# EAGLE design IGVC_breakout_board (EAGLE 7.1.0)
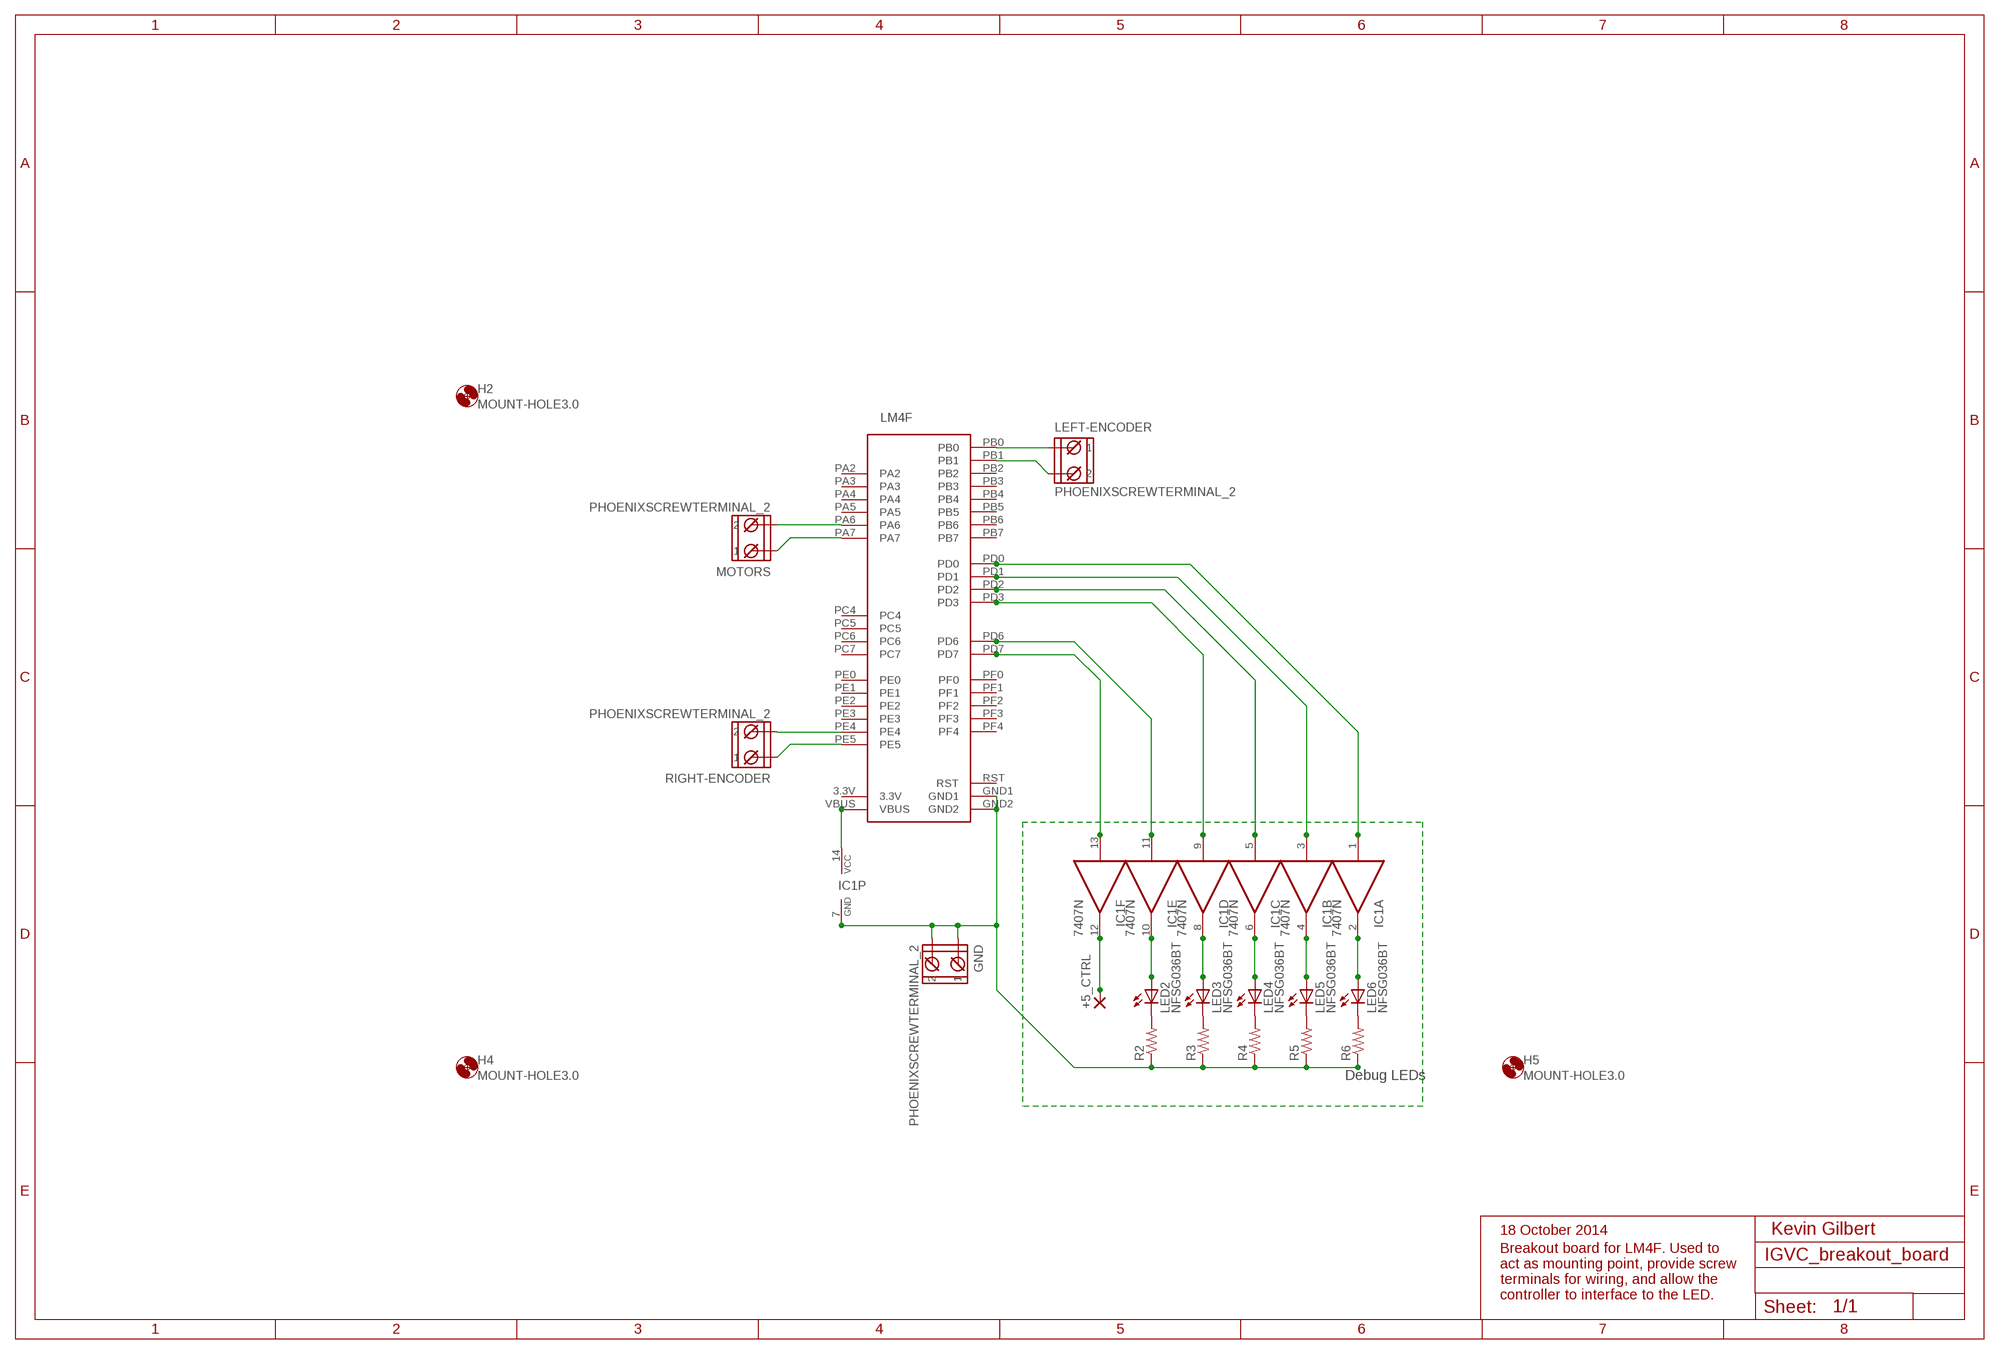
[diagram p0: schematic, sheet 1]

## Parts
+5_CTRL  1,6/0,8  [1,6/0,8]
GND  PHOENIXSCREWTERMINAL_2  [PHOENIXSCREWTERMINAL_2]
H2  MOUNT-HOLE3.0  [3,0]
H4  MOUNT-HOLE3.0  [3,0]
H5  MOUNT-HOLE3.0  [3,0]
IC1  7407N  [DIL14]
LED2  NFSG036BT  [NFSG036BT]
LED3  NFSG036BT  [NFSG036BT]
LED4  NFSG036BT  [NFSG036BT]
LED5  NFSG036BT  [NFSG036BT]
LED6  NFSG036BT  [NFSG036BT]
LEFT-ENCODER  PHOENIXSCREWTERMINAL_2  [PHOENIXSCREWTERMINAL_2]
LM4F  STELLARIS-LAUNCHPADSTELLARIS-LAUNCHPAD-XL  [LAUNCHPAD-XL]
MOTORS  PHOENIXSCREWTERMINAL_2  [PHOENIXSCREWTERMINAL_2]
R2  R-US_M0805  [M0805]
R3  R-US_M0805  [M0805]
R4  R-US_M0805  [M0805]
R5  R-US_M0805  [M0805]
R6  R-US_M0805  [M0805]
RIGHT-ENCODER  PHOENIXSCREWTERMINAL_2  [PHOENIXSCREWTERMINAL_2]

## Nets
GND: GND.1 GND.2 IC1.7(P:GND) LM4F.GND1 LM4F.GND2 R2.1 R3.1 R4.1 R5.1 R6.1
LEFT: IC1.1(A:I) LM4F.PD0
N$1: LM4F.PE4 RIGHT-ENCODER.2
N$2: LM4F.PA6 MOTORS.2
N$3: LM4F.PA7 MOTORS.1
N$4: LM4F.PE5 RIGHT-ENCODER.1
N$5: LEFT-ENCODER.1 LM4F.PB0
N$6: LEFT-ENCODER.2 LM4F.PB1
N$8: +5_CTRL.1(P) IC1.12(F:O)
N$9: LED2.C R2.2
N$10: LED3.C R3.2
N$11: LED4.C R4.2
N$12: LED5.C R5.2
N$13: LED6.C R6.2
N$15: IC1.10(E:O) LED2.A
N$16: IC1.8(D:O) LED3.A
N$17: IC1.6(C:O) LED4.A
N$18: IC1.4(B:O) LED5.A
N$19: IC1.2(A:O) LED6.A
N$21: IC1.3(B:I) LM4F.PD1
N$22: IC1.5(C:I) LM4F.PD2
N$23: IC1.9(D:I) LM4F.PD3
N$24: IC1.11(E:I) LM4F.PD6
N$25: IC1.13(F:I) LM4F.PD7
VBUS: IC1.14(P:VCC) LM4F.VBUS
Unconnected: LM4F.PA2 LM4F.PA3 LM4F.PA4 LM4F.PA5 LM4F.PB2 LM4F.PB3 LM4F.PB4 LM4F.PB5 LM4F.PB6 LM4F.PB7 LM4F.PC4 LM4F.PC5 LM4F.PC6 LM4F.PC7 LM4F.PE0 LM4F.PE1 LM4F.PE2 LM4F.PE3 LM4F.PF0 LM4F.PF1 LM4F.PF2 LM4F.PF3 LM4F.PF4

## Notes on the sheet
- Debug LEDs
- 18 October 2014 | Kevin Gilbert
- Breakout board for LM4F. Used to
  act as mounting point, provide screw
  terminals for wiring, and allow the
  controller to interface to the LED.

## Power pins joined to a net without a drawn wire
3.3V: LM4F.3.3V
RST: LM4F.RST

## Library data of the parts
+5_CTRL = wirepad:1,6/0,8: THROUGH-HOLE PAD
GND LEFT-ENCODER MOTORS RIGHT-ENCODER = RASEagleLib:PHOENIXSCREWTERMINAL_2: Phoenix Screw Terminal 2 contacts, 5 mm pitch Terminal: 1934861 Pins: 1933189
H2 H4 H5 = holes:MOUNT-HOLE: MOUNTING HOLE with drill center marker
IC1 = 74xx-eu:74*07: Hex BUFFER, open collector high-voltage output
LED2-LED6 = led:NFSG036BT: CHIP TYPE GREEN LED NFSx036xT Source: NICHIA CORPORATION .. NFSG036BT-E.pdf
LM4F = StellarisLaunchPad_Fred:STELLARIS-LAUNCHPAD
R2-R6 = resistor:R-US_: RESISTOR, American symbol

## Board
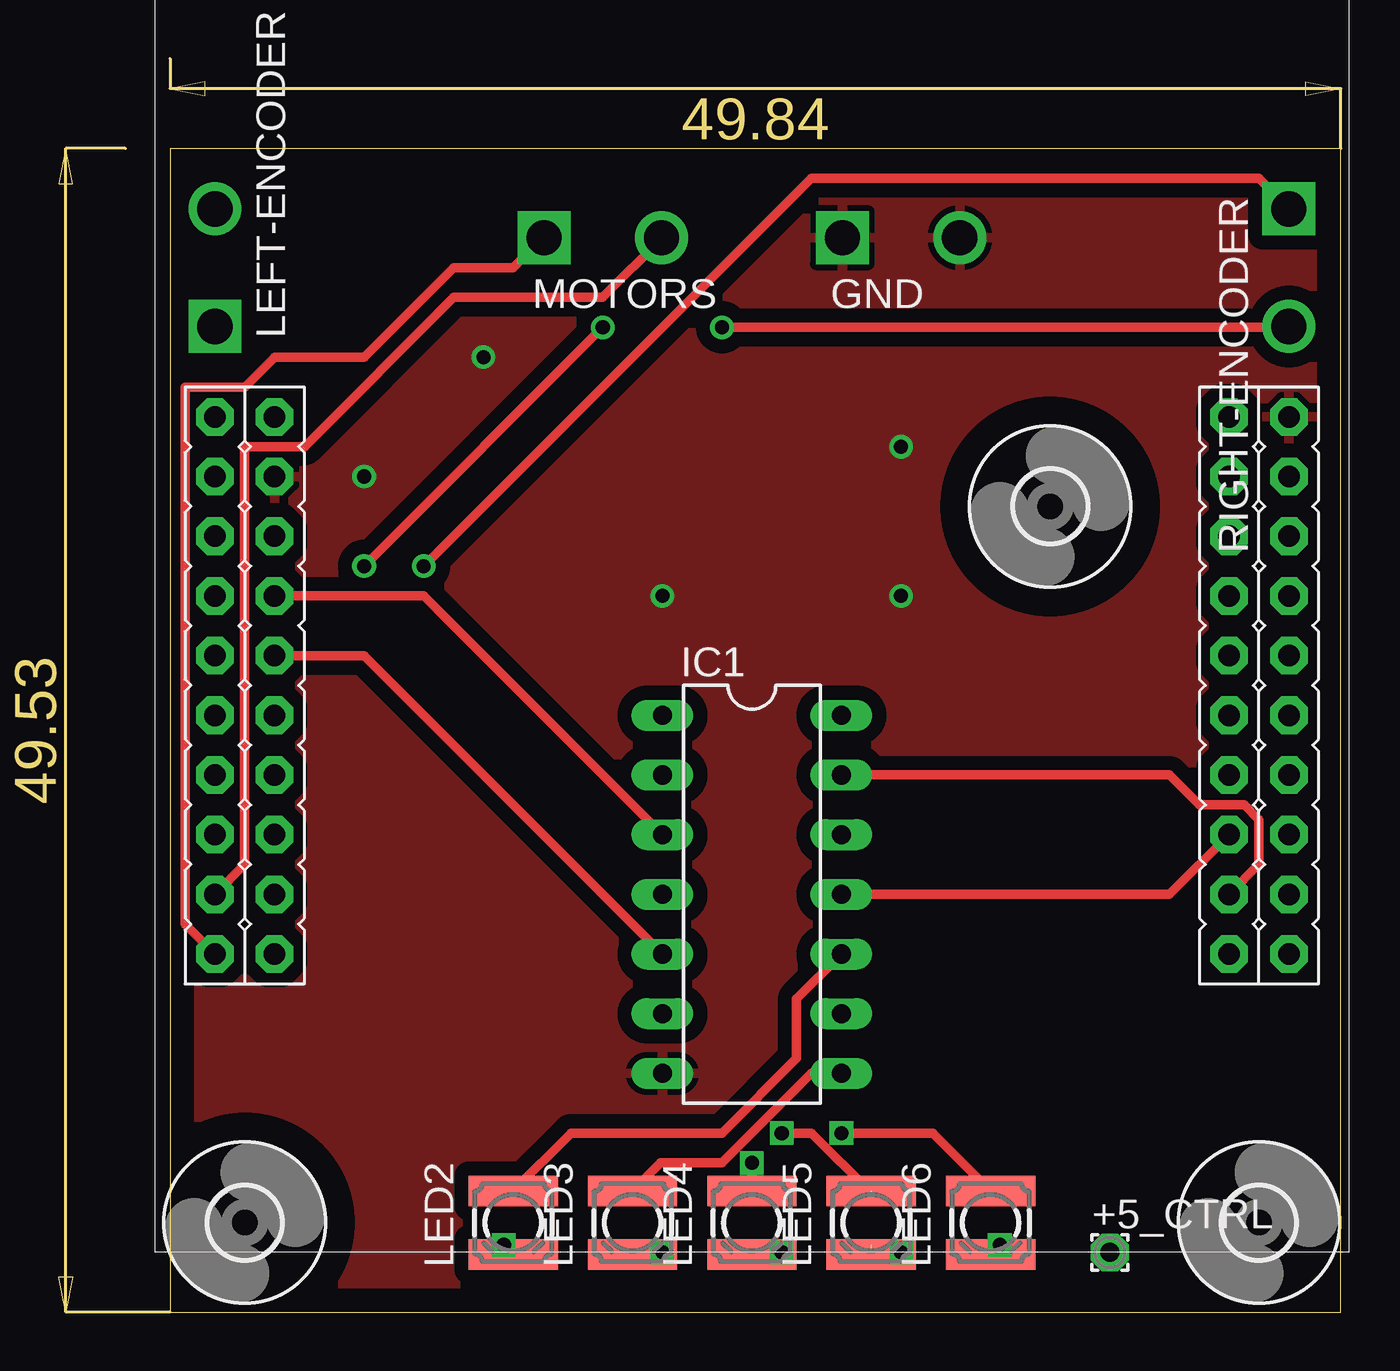
[diagram p1: board, top side]
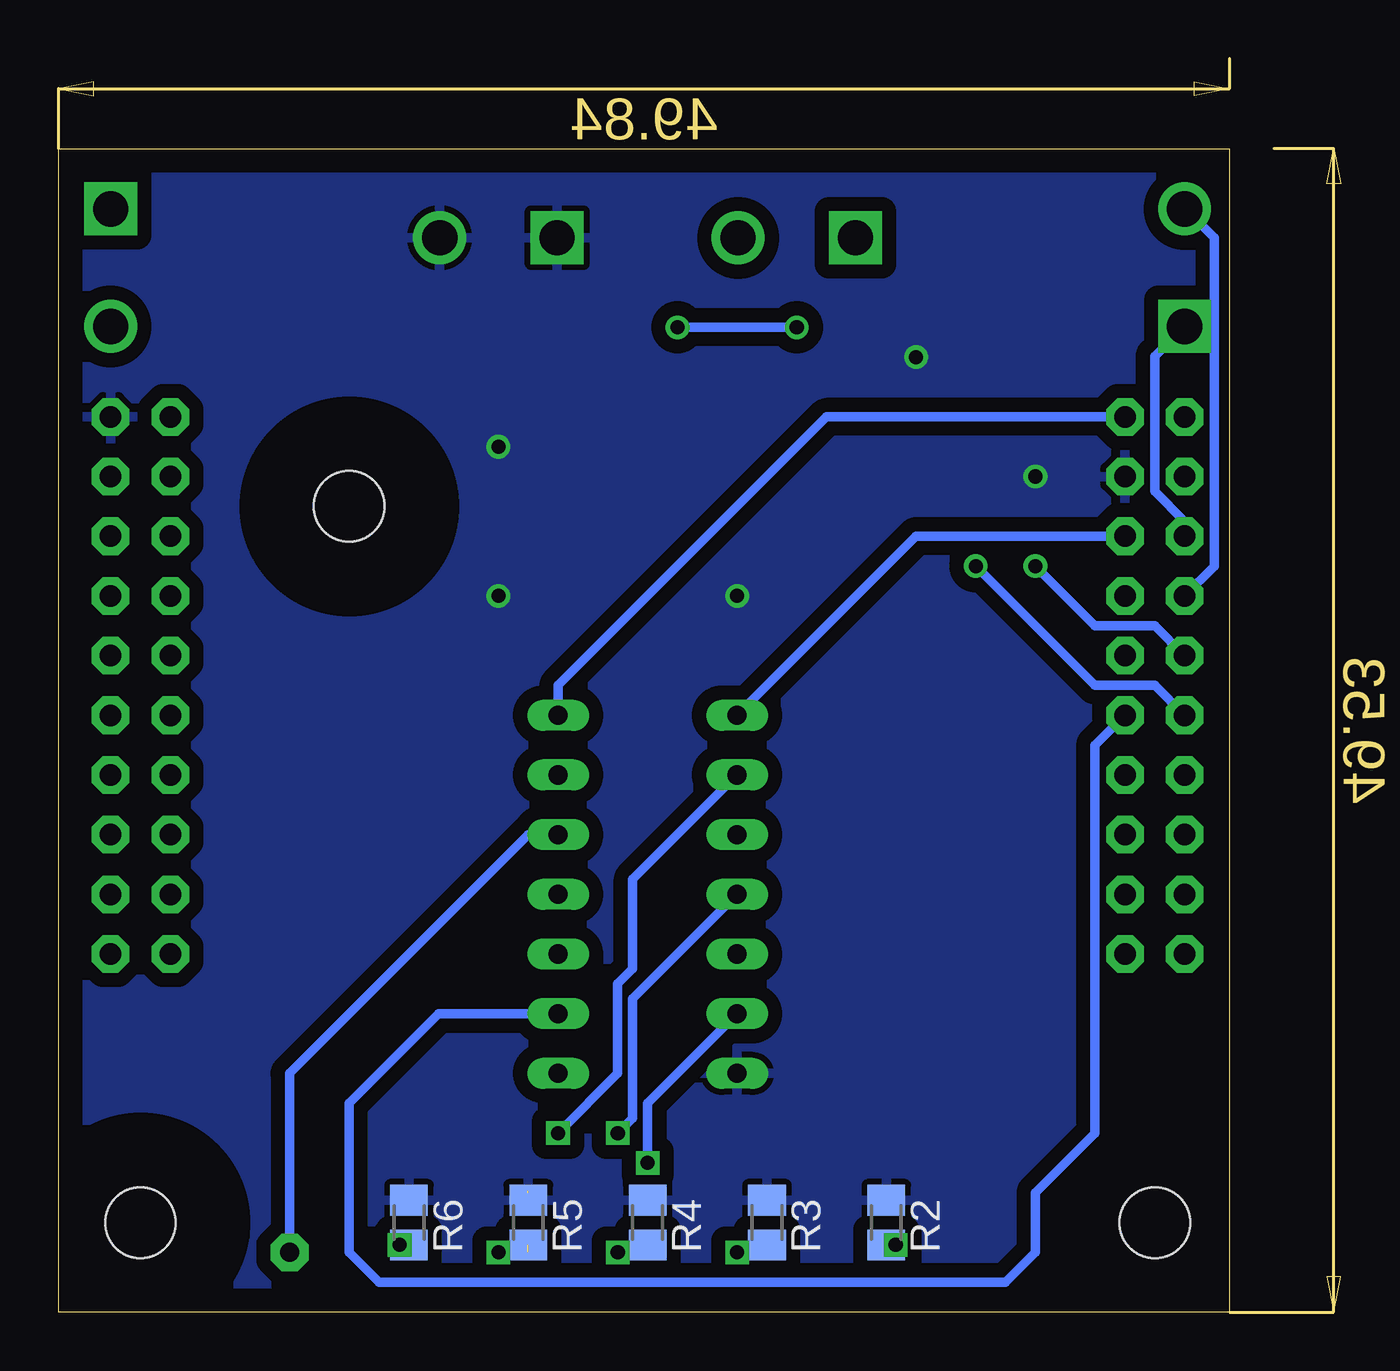
[diagram p2: board, bottom side, seen from below]

Size 49.84 x 49.52 mm. Coordinates in mm from the lower left corner, seen from the top.
Outline: 0,0 49.84,0 49.84,49.52 0,49.52 0,0
Copper layers (1*16): Top 0.035mm / dielectric 1.5mm / Bottom 0.035mm
Design rules "default": minimum track width 10mil, minimum drill 24mil, track to track 8mil, track to pad 8mil, pad to pad 8mil, via to via 8mil, smd to smd 8mil, copper to edge 40mil, drill to drill 8mil, minimum pad ring 10mil, minimum via ring 8mil, stop-mask expansion 4mil, vias tented up to drill 0mil, thermal gap 10mil

### Footprints (pad centres in the part's own frame; a part is rotated, then mirrored left to right if it is on the bottom)
1,6/0,8 = drill 0.813 pad 1.6 octagon: 1 0,0
PHOENIXSCREWTERMINAL_2 = drill 1.5 square: 1 -2.5,0 | drill 1.5: 2 2.5,0
3,0 = hole 3: 0,0
DIL14 = drill 0.813 long: 1 -7.62,-3.81; 2 -5.08,-3.81; 3 -2.54,-3.81; 4 0,-3.81; 5 2.54,-3.81; 6 5.08,-3.81; 7 7.62,-3.81; 8 7.62,3.81; 9 5.08,3.81; 10 2.54,3.81; 11 0,3.81; 12 -2.54,3.81; 13 -5.08,3.81; 14 -7.62,3.81
NFSG036BT = smd 1.3 x 3.8: A 1.35,0; C -1.35,0
LAUNCHPAD-XL = drill 0.914 pad 1.6 octagon: 3.3V 30.48,2.54; GND1 33.02,5.08; GND2 30.48,48.26; PA2 53.34,48.26; PA3 50.8,48.26; PA4 48.26,48.26; PA5 48.26,2.54; PA6 50.8,2.54; PA7 53.34,2.54; PB0 35.56,2.54; PB1 38.1,2.54; PB2 33.02,48.26; PB3 35.56,45.72; PB4 45.72,2.54; PB5 33.02,2.54; PB6 45.72,48.26; PB7 43.18,48.26; PC4 38.1,45.72; PC5 40.64,45.72; PC6 43.18,45.72; PC7 45.72,45.72; PD0 35.56,5.08; PD1 38.1,5.08; PD2 40.64,5.08; PD3 43.18,5.08; PD6 48.26,45.72; PD7 50.8,45.72; PE0 35.56,48.26; PE1 45.72,5.08; PE2 48.26,5.08; PE3 50.8,5.08; PE4 40.64,2.54; PE5 43.18,2.54; PF0 38.1,48.26; PF1 53.34,5.08; PF2 30.48,45.72; PF3 33.02,45.72; PF4 53.34,45.72; RST 40.64,48.26; VBUS 30.48,5.08
M0805 = smd 1.3 x 1.6: 1 -0.95,0; 2 0.95,0

### Placement (x,y rotation side)
+5_CTRL  40.01,2.54 0 top
GND  31.11,45.72 0 top
H2  46.36,3.81 0 top
H4  37.47,34.29 0 top
H5  3.17,3.81 0 top
IC1  24.76,17.78 270 top
LED2  14.61,3.81 90 top
LED3  19.68,3.81 90 top
LED4  24.76,3.81 90 top
LED5  29.84,3.81 90 top
LED6  34.93,3.81 90 top
LEFT-ENCODER  1.91,44.45 90 top
LM4F  -0.64,68.58 270 top
MOTORS  18.41,45.72 0 top
R2  14.61,3.81 270 bottom
R3  19.68,3.81 270 bottom
R4  24.76,3.81 270 bottom
R5  29.84,3.81 270 bottom
R6  34.93,3.81 270 bottom
RIGHT-ENCODER  47.62,44.45 270 top

### Tracks (layer width: path | path; a pad name or v marks a point on that pad's centre or on a via)
GND  (via drill 0.6)
  other vias: 31.11,36.83 31.11,30.48 20.95,30.48 8.26,35.56 13.34,40.64
  pour Top (isolate 0.61): 0,49.53 0,0 49.53,0 49.53,49.53
  pour Bottom (isolate 0.61): 0,49.53 0,0 49.53,0 49.53,49.53
LEFT
  Bottom 0.406: LM4F.PD0 13.34,33.02 IC1.1
N$1  (via drill 0.6)
  Top 0.406: v23.49,41.91 47.62,41.91 RIGHT-ENCODER.2 | v8.26,31.75 v18.41,41.91
  Bottom 0.406: v18.41,41.91 v23.49,41.91 | v8.26,31.75 5.71,29.21 3.17,29.21 LM4F.PE4
N$2
  Top 0.406: LM4F.PA6 3.17,19.05 3.17,36.83 5.71,36.83 12.06,43.18 18.41,43.18 20.95,45.72 MOTORS.2
N$3
  Top 0.406: LM4F.PA7 0.64,16.51 0.64,39.37 3.17,39.37 4.45,40.64 8.26,40.64 12.06,44.45 14.61,44.45 15.88,45.72 MOTORS.1
N$4  (via drill 0.6)
  Top 0.406: v10.79,31.75 27.3,48.26 46.36,48.26 47.62,46.99 RIGHT-ENCODER.1
  Bottom 0.406: v10.79,31.75 5.71,26.67 3.17,26.67 LM4F.PE5
N$5
  Bottom 0.406: LM4F.PB0 1.91,33.66 3.17,34.92 3.17,40.68 LEFT-ENCODER.1
N$6
  Bottom 0.406: LEFT-ENCODER.2 1.86,46.95 0.64,45.72 0.64,31.75 LM4F.PB1
N$8
  Bottom 0.406: IC1.12 29.84,20.32 40.01,10.16 +5_CTRL.1
N$9  (via drill 0.6)
  Top 0.406: v14.21,2.86 LED2.C
  Bottom 0.406: R2.2 v14.21,2.86
N$10  (via drill 0.6)
  Top 0.406: LED3.C 20.88,2.46 v20.95,2.54
  Bottom 0.406: v20.95,2.54 20,2.54 R3.2
N$11  (via drill 0.6)
  Top 0.406: LED4.C 25.95,2.46 v26.04,2.54
  Bottom 0.406: v26.04,2.54 25.08,2.54 R4.2
N$12  (via drill 0.6)  (1 unrouted)
  Top 0.406: LED5.C 31.04,2.46 v31.11,2.54
  Bottom 0.406: v31.11,2.54 29.84,2.54
N$13  (via drill 0.6)
  Top 0.406: v35.33,2.86 LED6.C
  Bottom 0.406: R6.2 v35.33,2.86
N$15
  Top 0.406: IC1.10 26.67,13.34 26.67,10.79 23.49,7.62 17.06,7.62 LED2.A
N$16
  Top 0.406: IC1.8 27.3,10.16 23.49,6.35 20.88,6.35 LED3.A
N$17  (via drill 0.6)
  Top 0.406: v24.76,6.35 LED4.A
  Bottom 0.406: IC1.6 24.76,8.89 v24.76,6.35
N$18  (via drill 0.6)  (1 unrouted)
  Top 0.406: v26.04,7.62 27.3,7.62 29.84,5.08
  Bottom 0.406: IC1.4 25.4,13.34 25.4,8.26 v26.04,7.62
N$19  (via drill 0.6)
  Top 0.406: v28.57,7.62 32.47,7.62 LED6.A
  Bottom 0.406: v28.57,7.62 26.04,10.16 26.04,13.97 25.4,14.61 25.4,18.41 IC1.2
N$21
  Top 0.406: LM4F.PD1 10.79,30.48 IC1.3
N$22
  Top 0.406: LM4F.PD2 8.26,27.94 IC1.5
N$23
  Bottom 0.406: LM4F.PD3 5.71,24.13 5.71,7.62 8.26,5.08 8.26,2.54 9.53,1.27 36.2,1.27 37.47,2.54 37.47,8.89 33.66,12.7 IC1.9
N$24
  Top 0.406: IC1.11 42.55,17.78 LM4F.PD6
N$25
  Top 0.406: IC1.13 42.55,22.86 43.82,21.59 45.72,21.59 46.36,20.95 46.36,19.05 LM4F.PD7
VBUS
  Bottom 0.406: LM4F.VBUS 17.14,38.1 28.57,26.67 IC1.14